# Altium schematic sheet BATTERY_GESTION.SchDoc: DARKYDEN_BATTERY_GESTION (part 1 of 3)
size Letter; ApprovedBy: APPROUVÉ PAR; Author: Harold Malbrouck; Organization: Cegep Limoilou; Address1: 1300, 8e Avenue; Address2: Québec, QC; Address3: Canada; Address4: G1J 5L5; Revision: Rev.A; SheetNumber: 17; SheetTotal: 22
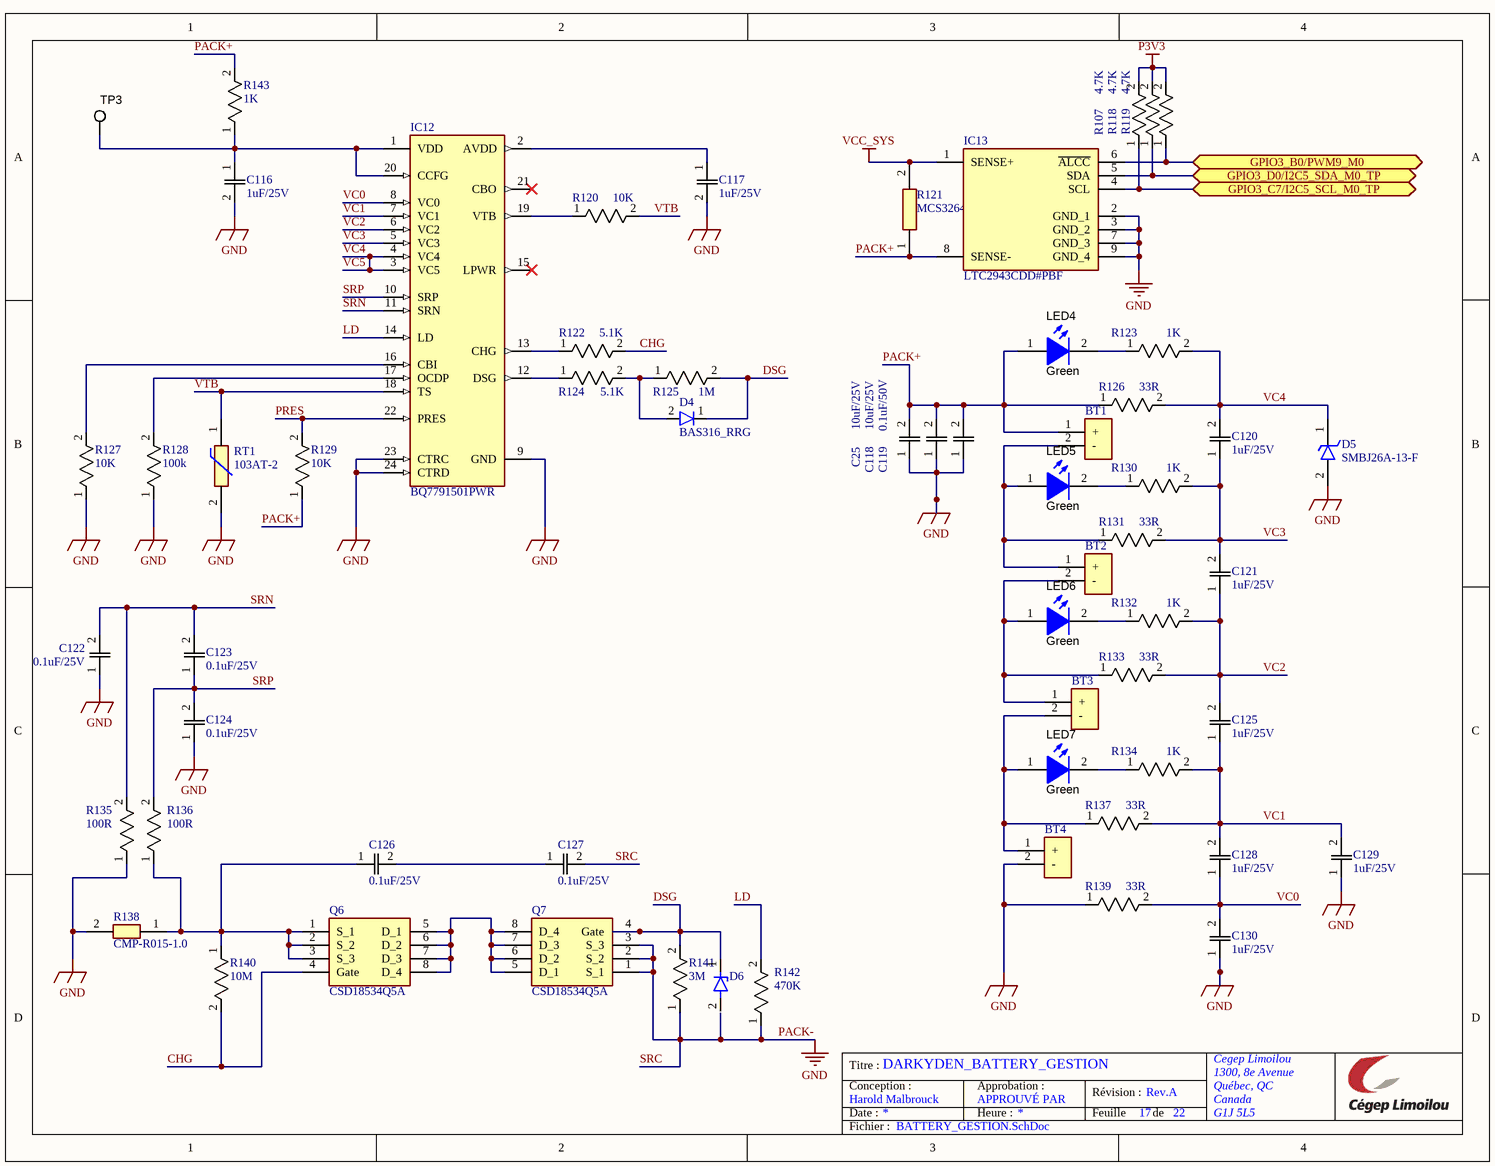
[diagram p0: BATTERY_GESTION.SchDoc]

## Parts
BT1  0530480210  [SHDRRA2W35P0X125_1X2_425X550X350P]  (value not drawn)
BT2  0530480210  [SHDRRA2W35P0X125_1X2_425X550X350P]  (value not drawn)
BT3  0530480210  [SHDRRA2W35P0X125_1X2_425X550X350P]  (value not drawn)
BT4  0530480210  [SHDRRA2W35P0X125_1X2_425X550X350P]  (value not drawn)
C25  10uF/25V  [CAPC220145_88N_KEM]
C116  1uF/25V  [C0805]
C117  1uF/25V  [C0805]
C118  10uF/25V  [CAPC220145_88N_KEM]
C119  0.1uF/50V  [C0805]
C120  1uF/25V  [C0805]
C121  1uF/25V  [C0805]
C122  0.1uF/25V  [CAPC220145_88N_KEM]
C123  0.1uF/25V  [CAPC220145_88N_KEM]
C124  0.1uF/25V  [CAPC220145_88N_KEM]
C125  1uF/25V  [C0805]
C126  0.1uF/25V  [CAPC220145_88N_KEM]
C127  0.1uF/25V  [CAPC220145_88N_KEM]
C128  1uF/25V  [C0805]
C129  1uF/25V  [C0805]
C130  1uF/25V  [C0805]
D4  BAS316_RRG  [BAS316RRG]
D5  SMBJ26A-13-F  [DIOM5336X250N]
D6  MMSZ5248B-7-F  [SOD3716X115N]  (value not drawn)
IC12  BQ7791501PWR  [SOP65P640X120-24N]
IC13  LTC2943CDD#PBF  [SON50P300X300X80-9N-D]
LED4  value Green  [LED_LTST-C190]  (hidden comment: LTST-C190GKT)
LED5  value Green  [LED_LTST-C190]  (hidden comment: LTST-C190GKT)
LED6  value Green  [LED_LTST-C190]  (hidden comment: LTST-C190GKT)
LED7  value Green  [LED_LTST-C190]  (hidden comment: LTST-C190GKT)
Q6  CSD18534Q5A  [Q5A]
Q7  CSD18534Q5A  [Q5A]
R107  4.7K  [RC0603N_PAN]
R118  4.7K  [RC0603N_PAN]
R119  4.7K  [RC0603N_PAN]
R120  10K  [ERJ3EKF1000V]
R121  MCS3264R010FER  [RESC6432X62N]
R122  5.1K  [ERA3AEB101V]
R123  1K  [RESC1608X55N]
R124  5.1K  [ERA3AEB101V]
R125  1M  [ERJ3EKF1000V]
R126  33R  [RC0603N_PAN]
R127  10K  [ERJ3EKF1000V]
R128  100k  [ERJ3EKF1000V]
R129  10K  [ERJ3EKF1000V]
R130  1K  [RESC1608X55N]
R131  33R  [RC0603N_PAN]
R132  1K  [RESC1608X55N]
R133  33R  [RC0603N_PAN]
R134  1K  [RESC1608X55N]
R135  100R  [RESC1608X55N]
R136  100R  [RESC1608X55N]
R137  33R  [RC0603N_PAN]
R138  CMP-R015-1.0  [RESC5025X70N]
R139  33R  [RC0603N_PAN]
R140  10M  [ERJS03J155V]
R141  3M  [ERJ3EKF1000V]
R142  470K  [RESC1608X55N]
R143  1K  [RESC1608X55N]
RT1  103AT-2  [103AT2]
TP3  5016  [Testpoint_Keystone_Compact]  (value not drawn)

## Ports
GPIO3_B0/PWM9_M0 (bidir, see CONNECTEUR_4[3C]), GPIO3_C7/I2C5_SCL_M0_TP (bidir, see CONNECTEUR_4[1C]), GPIO3_D0/I2C5_SDA_M0_TP (bidir, see CONNECTEUR_4[1C])

## Nets
P3V3: R107.2 R118.2 R119.2
PACK-: BT4.2(-) C25.1 C116.2 C117.2 C118.1 C119.1 C122.1 C124.1 C127.2 C129.1 C130.1 D5.2(A) IC12.9(GND) IC12.23(CTRC) IC12.24(CTRD) IC13.2(GND_1) IC13.3(GND_2) IC13.7(GND_3) IC13.9(GND_4) Q7.1(S_1) Q7.2(S_2) Q7.3(S_3) R127.1 R128.1 R135.1 R138.2 R139.1 R141.1 R142.1 RT1.2  [also labelled GND, SRC]
VCC_SYS: IC13.1(SENSE+) R121.2
CHG: Q6.4(Gate) R122.2 R140.2
DSG: D4.1(K) D6.1(K) Q7.4(Gate) R125.2 R141.2
GPIO3_B0/PWM9_M0: IC13.6(~{ALCC}) R119.1 ; port GPIO3_B0/PWM9_M0
GPIO3_C7/I2C5_SCL_M0_TP: IC13.4(SCL) R107.1 ; port GPIO3_C7/I2C5_SCL_M0_TP
GPIO3_D0/I2C5_SDA_M0_TP: IC13.5(SDA) R118.1 ; port GPIO3_D0/I2C5_SDA_M0_TP
LD: IC12.14(LD) R142.2
PACK+: BT1.1(+) C25.2 C118.2 C119.2 IC13.8(SENSE-) LED4.1(A) R121.1 R126.1 R129.1 R143.2
PRES: IC12.22(PRES) R129.2
SRN: C122.2 C123.2 IC12.11(SRN) R135.2
SRP: C123.1 C124.2 IC12.10(SRP) R136.2
VC0: C128.1 C130.2 IC12.8(VC0) R139.2
VC1: C125.1 C128.2 C129.2 IC12.7(VC1) R134.2 R137.2
VC2: C121.1 C125.2 IC12.6(VC2) R132.2 R133.2
VC3: C120.1 C121.2 IC12.5(VC3) R130.2 R131.2
VC4: C120.2 D5.1(K) IC12.3(VC5) IC12.4(VC4) R123.2 R126.2  [also labelled VC5]
VTB: IC12.18(TS) R120.2 RT1.1
NetBT1_2: BT1.2(-) BT2.1(+) LED5.1(A) R131.1
NetBT2_2: BT2.2(-) BT3.1(+) LED6.1(A) R133.1
NetBT3_2: BT3.2(-) BT4.1(+) LED7.1(A) R137.1
NetC116_1: C116.1 IC12.1(VDD) IC12.20(CCFG) R143.1 TP3.1
NetC117_1: C117.1 IC12.2(AVDD)
NetC126_1: C126.1 Q6.1(S_1) Q6.2(S_2) Q6.3(S_3) R136.1 R138.1 R140.1
NetC126_2: C126.2 C127.1
NetD4_2: D4.2(A) R124.2 R125.1
NetIC12_12: IC12.12(DSG) R124.1
NetIC12_13: IC12.13(CHG) R122.1
NetIC12_16: IC12.16(CBI) R127.2
NetIC12_17: IC12.17(OCDP) R128.2
NetIC12_19: IC12.19(VTB) R120.1
NetLED4_2: LED4.2(K) R123.1
NetLED5_2: LED5.2(K) R130.1
NetLED6_2: LED6.2(K) R132.1
NetLED7_2: LED7.2(K) R134.1
NetQ6_5: Q6.5(D_1) Q6.6(D_2) Q6.7(D_3) Q6.8(D_4) Q7.5(D_1) Q7.6(D_2) Q7.7(D_3) Q7.8(D_4)

Not connected (* = marked no-connect by the designer): D6 2(A); IC12 15(LPWR)* 21(CBO)*

## Notes on the sheet
- Titre :
- Conception :
- Date :
- Approbation :
- Heure :
- Révision :
- Feuille
- de
- Fichier :